# Altium schematic sheet General_Tranceivers.SchDoc
size A4; SheetNumber: 2; SheetTotal: 7
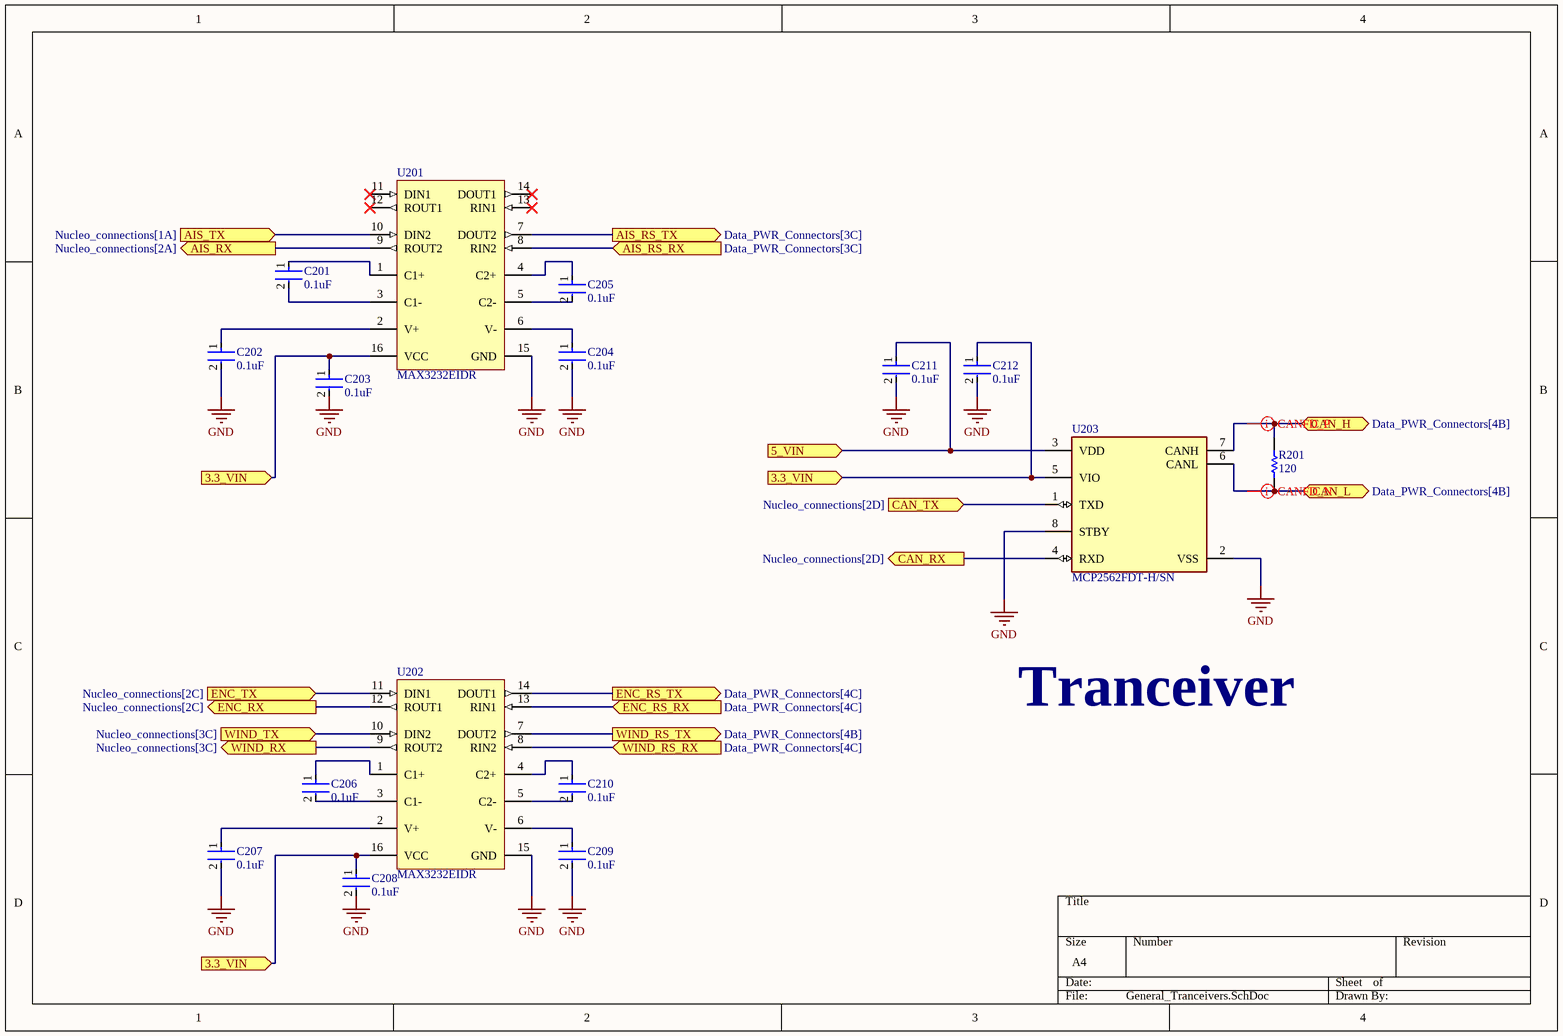
[diagram p0: General_Tranceivers.SchDoc]

## Parts
C201  0.1uF  [FP-GCM21B-0_15-MFG]
C202  0.1uF  [FP-GCM21B-0_15-MFG]
C203  0.1uF  [FP-GCM21B-0_15-MFG]
C204  0.1uF  [FP-GCM21B-0_15-MFG]
C205  0.1uF  [FP-GCM21B-0_15-MFG]
C206  0.1uF  [FP-GCM21B-0_15-MFG]
C207  0.1uF  [FP-GCM21B-0_15-MFG]
C208  0.1uF  [FP-GCM21B-0_15-MFG]
C209  0.1uF  [FP-GCM21B-0_15-MFG]
C210  0.1uF  [FP-GCM21B-0_15-MFG]
C211  0.1uF  [FP-GCM21B-0_15-MFG]
C212  0.1uF  [FP-GCM21B-0_15-MFG]
R201  120  [RESC2013X60X35ML10T20]
U201  MAX3232EIDR  [D0016A_N]
U202  MAX3232EIDR  [D0016A_N]
U203  MCP2562FDT-H/SN  [FP-C04-057-SN-IPC_A]

## Ports
3.3_VIN (in, see General_Tranceivers[1B], General_Tranceivers[1D], Nucleo_connections[2B], SERVO_CAN[1B], SERVO_CAN[2C]), 3.3_VIN (in, see General_Tranceivers[1B], General_Tranceivers[2B], Nucleo_connections[2B], SERVO_CAN[1B], SERVO_CAN[2C]), 3.3_VIN (in, see General_Tranceivers[1D], General_Tranceivers[2B], Nucleo_connections[2B], SERVO_CAN[1B], SERVO_CAN[2C]), 5_VIN (in, see Data_PWR_Connectors[1C], Nucleo_connections[2A], Power_Management[3A], Power_Management[4C], SERVO_CAN[1B]), AIS_RS_RX (in, see Data_PWR_Connectors[3C]), AIS_RS_TX (out, see Data_PWR_Connectors[3C]), AIS_RX (out, see Nucleo_connections[2A]), AIS_TX (in, see Nucleo_connections[1A]), CAN_H (bidir, see Data_PWR_Connectors[4B]), CAN_L (bidir, see Data_PWR_Connectors[4B]), CAN_RX (out, see Nucleo_connections[2D]), CAN_TX (in, see Nucleo_connections[2D]), ENC_RS_RX (in, see Data_PWR_Connectors[4C]), ENC_RS_TX (out, see Data_PWR_Connectors[4C]), ENC_RX (out, see Nucleo_connections[2C]), ENC_TX (in, see Nucleo_connections[2C]), WIND_RS_RX (in, see Data_PWR_Connectors[4C]), WIND_RS_TX (out, see Data_PWR_Connectors[4B]), WIND_RX (out, see Nucleo_connections[3C]), WIND_TX (in, see Nucleo_connections[3C])

## Nets
GND: C202.2 C203.2 C204.2 C207.2 C208.2 C209.2 C211.2 C212.2 U201.15(GND) U202.15(GND) U203.2(VSS) U203.8(STBY)
3.3_VIN: C203.1 C208.1 C212.1 U201.16(VCC) U202.16(VCC) U203.5(VIO) ; port 3.3_VIN
5_VIN: C211.1 U203.3(VDD) ; port 5_VIN
AIS_RS_RX: U201.8(RIN2) ; port AIS_RS_RX
AIS_RS_TX: U201.7(DOUT2) ; port AIS_RS_TX
AIS_RX: U201.9(ROUT2) ; port AIS_RX
AIS_TX: U201.10(DIN2) ; port AIS_TX
CAN_H: R201.1 U203.7(CANH) ; port CAN_H
CAN_L: R201.2 U203.6(CANL) ; port CAN_L
CAN_RX: U203.4(RXD) ; port CAN_RX
CAN_TX: U203.1(TXD) ; port CAN_TX
ENC_RS_RX: U202.13(RIN1) ; port ENC_RS_RX
ENC_RS_TX: U202.14(DOUT1) ; port ENC_RS_TX
ENC_RX: U202.12(ROUT1) ; port ENC_RX
ENC_TX: U202.11(DIN1) ; port ENC_TX
WIND_RS_RX: U202.8(RIN2) ; port WIND_RS_RX
WIND_RS_TX: U202.7(DOUT2) ; port WIND_RS_TX
WIND_RX: U202.9(ROUT2) ; port WIND_RX
WIND_TX: U202.10(DIN2) ; port WIND_TX
NetC201_1: C201.1 U201.1(C1+)
NetC201_2: C201.2 U201.3(C1-)
NetC202_1: C202.1 U201.2(V+)
NetC204_1: C204.1 U201.6(V-)
NetC205_1: C205.1 U201.4(C2+)
NetC205_2: C205.2 U201.5(C2-)
NetC206_1: C206.1 U202.1(C1+)
NetC206_2: C206.2 U202.3(C1-)
NetC207_1: C207.1 U202.2(V+)
NetC209_1: C209.1 U202.6(V-)
NetC210_1: C210.1 U202.4(C2+)
NetC210_2: C210.2 U202.5(C2-)

Not connected (* = marked no-connect by the designer): U201 11(DIN1)* 12(ROUT1)* 13(RIN1)* 14(DOUT1)*

## Layout directives
differential pair: CAN_H, CAN_L

## Notes on the sheet
- Tranceiver

## Library data of the parts
C201-C212 = CMP-2007-03364-2: Ceramic Capacitor for Automotive 100nF ±10% 100VDC X7R 0805 Embossed T/R; Voltage Rating: 100V; Termination: SMD/SMT; Tolerance: 10%; Case Code (Imperial): 0805; Length: 2mm; Max Operating Temperature: 125°C; Case/Package: 0805; Mount: Surface Mount; Packaging: Tape and Reel; Package Quantity: 1; Min Operating Temperature: -55°C; Case Code (Metric): 2012; Radiation Hardening: No; REACH SVHC: No SVHC; Dielectric: X7R; Depth: 1.25mm; Lead Free: Lead Free; Ratings: AEC-Q200; Height: 1.25mm; Voltage: 100V; Capacitance: 100nF; Voltage Rating (DC): 100V; Width: 0.049inch; Thickness: 0.055inch
R201 = CMP-2100-03671-1: Chip Resistor, 1 KOhm, +/- 1%, 125 mW, -55 to 155 degC, 0805 (2012 Metric), RoHS, Tape and Reel; Manufacturer: Yageo; Temperature Coefficient: 100ppm/degreesC; Voltage Rating (DC): 150V; Max Power Dissipation: 125mW; Resistance: 1KOhm; Number of Pins: 2; Number of Terminations: 2; Datasheet URL: http://www.yageo.com/NewPortal/yageodocoutput?fileName=/pdf/R-Chip/PYu-RC_Group_51_RoHS_L_5.pdf; Length: 0.079inch; Package Description: 2-Pin Surface Mounted Device, Body 2 x 1.25 mm; Depth: 1.25mm; Height: 0.024inch; Military Standard: Not; Case/Package: 0805; Package Reference: 0805; RoHSCompliant: true; Lead Free: LeadFree; Packaging: TapeandReel; Package Quantity: 1; Datasheet Version: Rev. 5, 10/2016; Tolerance: 1%; Min Operating Temperature: -55degC; Voltage Rating: 150V; Composition: ThickFilm; Case Code (Imperial): 0805; Power Rating: 125mW; Width: 0.049inch; Case Code (Metric): 2012; Manufacturer URL: http://www.yageo.com/; Max Operating Temperature: 155degC; REACH SVHC: Unknown; Termination: SMD/SMT
U201 U202 = CMP-0299-00792-2: 3-V to 5.5-V Multichannel RS-232 Line Driver / Receiver with ±15-kV IEC ESD Protection, -40 to 85 degC, 16-Pin SOIC (D), Green (RoHS & no Sb/Br); Drivers Per Package: 2; IEC-61000-4-2 SUPPORT: TRUE; Supply Voltage(s)(V): 3.3 or 5.0; ICC(Max)(mA): 1; ESD HBM(kV): +/-15; PackageVersion: revM, Jun-2011; ComponentLink2URL: http://www.ti.com/general/docs/lit/getliterature.tsp?genericPartNumber=MAX3232E&fileType=pdf; PackageReference: D0016A; DatasheetVersion: SLLS664A; ComponentLink3Description: Package Specification; PackageDescription: 16-Pin Plastic Small Outline Integrated Circuit, 9.9 x 3.9 mm, Pitch 1.27 mm Pitch; SubFamily: RS-232; Single Supply: TRUE; RS-232: TRUE; ComponentLink1Description: Manufacturer URL; ComponentLink1URL: www.ti.com; ComponentLink3URL: http://www.ti.com/litv/pdf/mpds178g; Receivers Per Package: 2; ComponentLink2Description: Datasheet
U203 = CMP-06279-000047-1: IC TRANSCEIVER 1/1 8SOIC; Operating Supply Current: 70mA; Receiver Hysteresis: 200mV; Max Supply Voltage: 5.5V; Number of Transceivers: 1; Min Supply Voltage: 4.5V; Data Rate: 8Mbps; Case/Package: SOIC; Weight: 0.019048oz; Package Quantity: 3300; Max Operating Temperature: 150°C; Packaging: Tape and Reel; RoHS Compliant: Yes; Series: -; Number of Pins: 8; Min Operating Temperature: -40°C; Mount: Surface Mount